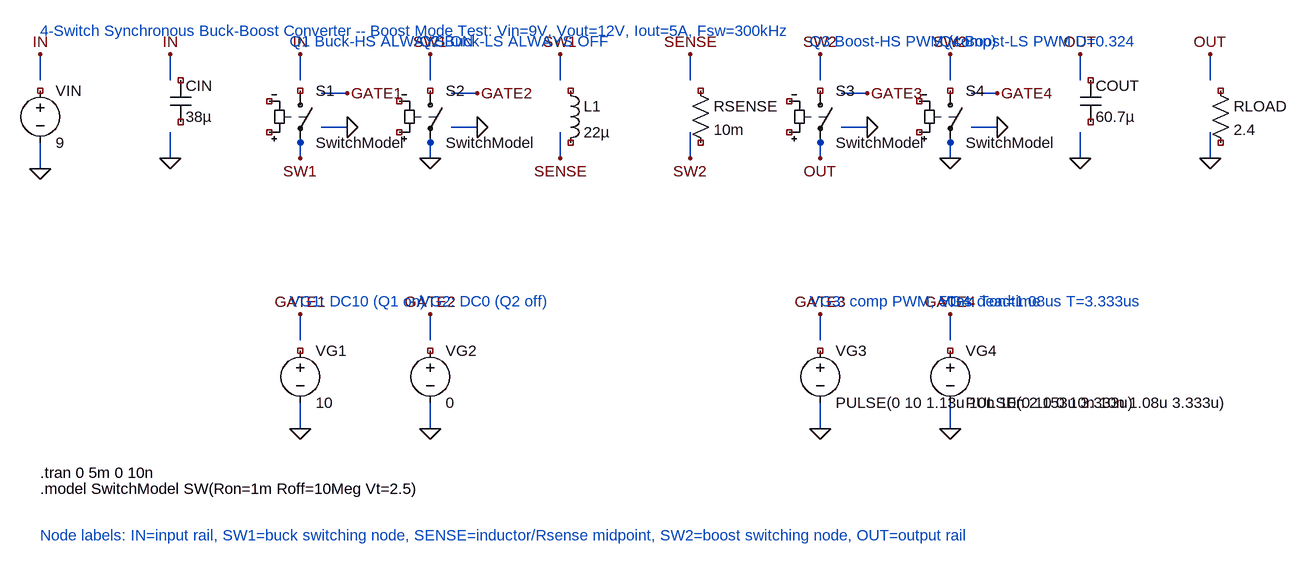
[diagram p0: schematic buc.asc]
buc.asc, the LTspice schematic file:
Version 4.1
SHEET 1 2200 900
WIRE 80 100 80 60
WIRE 280 100 280 60
WIRE 480 100 480 60
WIRE 680 100 680 60
WIRE 880 100 880 60
WIRE 1080 100 1080 60
WIRE 1280 100 1280 60
WIRE 1480 100 1480 60
WIRE 1680 100 1680 60
WIRE 1880 100 1880 60
WIRE 552 120 512 120
WIRE 752 120 712 120
WIRE 1352 120 1312 120
WIRE 1552 120 1512 120
WIRE 552 172 512 172
WIRE 752 172 712 172
WIRE 1352 172 1312 172
WIRE 1552 172 1512 172
WIRE 480 196 480 180
WIRE 680 196 680 180
WIRE 1280 196 1280 180
WIRE 1480 196 1480 180
WIRE 280 220 280 180
WIRE 480 220 480 196
WIRE 680 220 680 196
WIRE 880 220 880 180
WIRE 1080 220 1080 180
WIRE 1280 220 1280 196
WIRE 1480 220 1480 196
WIRE 1680 220 1680 180
WIRE 1880 220 1880 180
WIRE 80 236 80 196
WIRE 480 500 480 460
WIRE 680 500 680 460
WIRE 1280 500 1280 460
WIRE 1480 500 1480 460
WIRE 480 636 480 596
WIRE 680 636 680 596
WIRE 1280 636 1280 596
WIRE 1480 636 1480 596
FLAG 80 60 IN
FLAG 80 236 0
FLAG 280 60 IN
FLAG 280 220 0
FLAG 480 60 IN
FLAG 480 220 SW1
FLAG 552 120 GATE1
FLAG 552 172 0
FLAG 680 60 SW1
FLAG 680 220 0
FLAG 752 120 GATE2
FLAG 752 172 0
FLAG 880 60 SW1
FLAG 880 220 SENSE
FLAG 1080 60 SENSE
FLAG 1080 220 SW2
FLAG 1280 60 SW2
FLAG 1280 220 OUT
FLAG 1352 120 GATE3
FLAG 1352 172 0
FLAG 1480 60 SW2
FLAG 1480 220 0
FLAG 1552 120 GATE4
FLAG 1552 172 0
FLAG 1680 60 OUT
FLAG 1680 220 0
FLAG 1880 60 OUT
FLAG 1880 220 0
FLAG 480 460 GATE1
FLAG 480 636 0
FLAG 680 460 GATE2
FLAG 680 636 0
FLAG 1280 460 GATE3
FLAG 1280 636 0
FLAG 1480 460 GATE4
FLAG 1480 636 0
SYMBOL voltage 80 100 R0
SYMATTR InstName VIN
SYMATTR Value 9
SYMBOL cap 280 100 R0
SYMATTR InstName CIN
SYMATTR Value 38µ
SYMATTR SpiceLine Rser=2m
SYMBOL sw 480 100 R0
SYMATTR InstName S1
SYMATTR Value SwitchModel
SYMBOL sw 680 100 R0
SYMATTR InstName S2
SYMATTR Value SwitchModel
SYMBOL ind 880 100 R0
SYMATTR InstName L1
SYMATTR Value 22µ
SYMATTR SpiceLine Rser=10m
SYMBOL res 1080 100 R0
SYMATTR InstName RSENSE
SYMATTR Value 10m
SYMBOL sw 1280 100 R0
SYMATTR InstName S3
SYMATTR Value SwitchModel
SYMBOL sw 1480 100 R0
SYMATTR InstName S4
SYMATTR Value SwitchModel
SYMBOL cap 1680 100 R0
SYMATTR InstName COUT
SYMATTR Value 60.7µ
SYMATTR SpiceLine Rser=5m
SYMBOL res 1880 100 R0
SYMATTR InstName RLOAD
SYMATTR Value 2.4
SYMBOL voltage 480 500 R0
SYMATTR InstName VG1
SYMATTR Value 10
SYMBOL voltage 680 500 R0
SYMATTR InstName VG2
SYMATTR Value 0
SYMBOL voltage 1280 500 R0
SYMATTR InstName VG3
SYMATTR Value PULSE(0 10 1.13u 10n 10n 2.153u 3.333u)
SYMBOL voltage 1480 500 R0
SYMATTR InstName VG4
SYMATTR Value PULSE(0 10 0 10n 10n 1.08u 3.333u)
TEXT 80 24 Left 2 ;4-Switch Synchronous Buck-Boost Converter -- Boost Mode Test: Vin=9V, Vout=12V, Iout=5A, Fsw=300kHz
TEXT 464 40 Left 2 ;Q1 Buck-HS ALWAYS ON
TEXT 664 40 Left 2 ;Q2 Buck-LS ALWAYS OFF
TEXT 1264 40 Left 2 ;Q3 Boost-HS PWM (comp)
TEXT 1464 40 Left 2 ;Q4 Boost-LS PWM D=0.324
TEXT 464 440 Left 2 ;VG1: DC10 (Q1 on)
TEXT 664 440 Left 2 ;VG2: DC0 (Q2 off)
TEXT 1264 440 Left 2 ;VG3: comp PWM, 50ns deadtime
TEXT 1464 440 Left 2 ;VG4: Ton=1.08us T=3.333us
TEXT 80 704 Left 2 !.tran 0 5m 0 10n
TEXT 80 728 Left 2 !.model SwitchModel SW(Ron=1m Roff=10Meg Vt=2.5)
TEXT 80 800 Left 2 ;Node labels: IN=input rail, SW1=buck switching node, SENSE=inductor/Rsense midpoint, SW2=boost switching node, OUT=output rail

The netlist it stands for:
* buc.asc
VIN NC_01 0 9
CIN NC_02 NC_03 38µ Rser=2m
* S1: SwitchModel (symbol sw not certain, pin order unknown); nets seen at it: SW1
* S2: SwitchModel (symbol sw not certain, pin order unknown); nets seen at it: 0
L1 NC_10 NC_11 22µ Rser=10m
RSENSE NC_12 NC_13 10m
* S3: SwitchModel (symbol sw not certain, pin order unknown); nets seen at it: OUT
* S4: SwitchModel (symbol sw not certain, pin order unknown); nets seen at it: 0
COUT NC_20 NC_21 60.7µ Rser=5m
RLOAD NC_22 NC_23 2.4
VG1 NC_24 0 10
VG2 NC_25 0 0
VG3 NC_26 0 PULSE(0 10 1.13u 10n 10n 2.153u 3.333u)
VG4 NC_27 0 PULSE(0 10 0 10n 10n 1.08u 3.333u)
* 4-Switch Synchronous Buck-Boost Converter -- Boost Mode Test: Vin=9V, Vout=12V, Iout=5A, Fsw=300kHz
* Q1 Buck-HS ALWAYS ON
* Q2 Buck-LS ALWAYS OFF
* Q3 Boost-HS PWM (comp)
* Q4 Boost-LS PWM D=0.324
* VG1: DC10 (Q1 on)
* VG2: DC0 (Q2 off)
* VG3: comp PWM, 50ns deadtime
* VG4: Ton=1.08us T=3.333us
.tran 0 5m 0 10n
.model SwitchModel SW(Ron=1m Roff=10Meg Vt=2.5)
* Node labels: IN=input rail, SW1=buck switching node, SENSE=inductor/Rsense midpoint, SW2=boost switching node, OUT=output rail
.backanno
.end